# Altium schematic sheet Power Supply.SchDoc
size A4
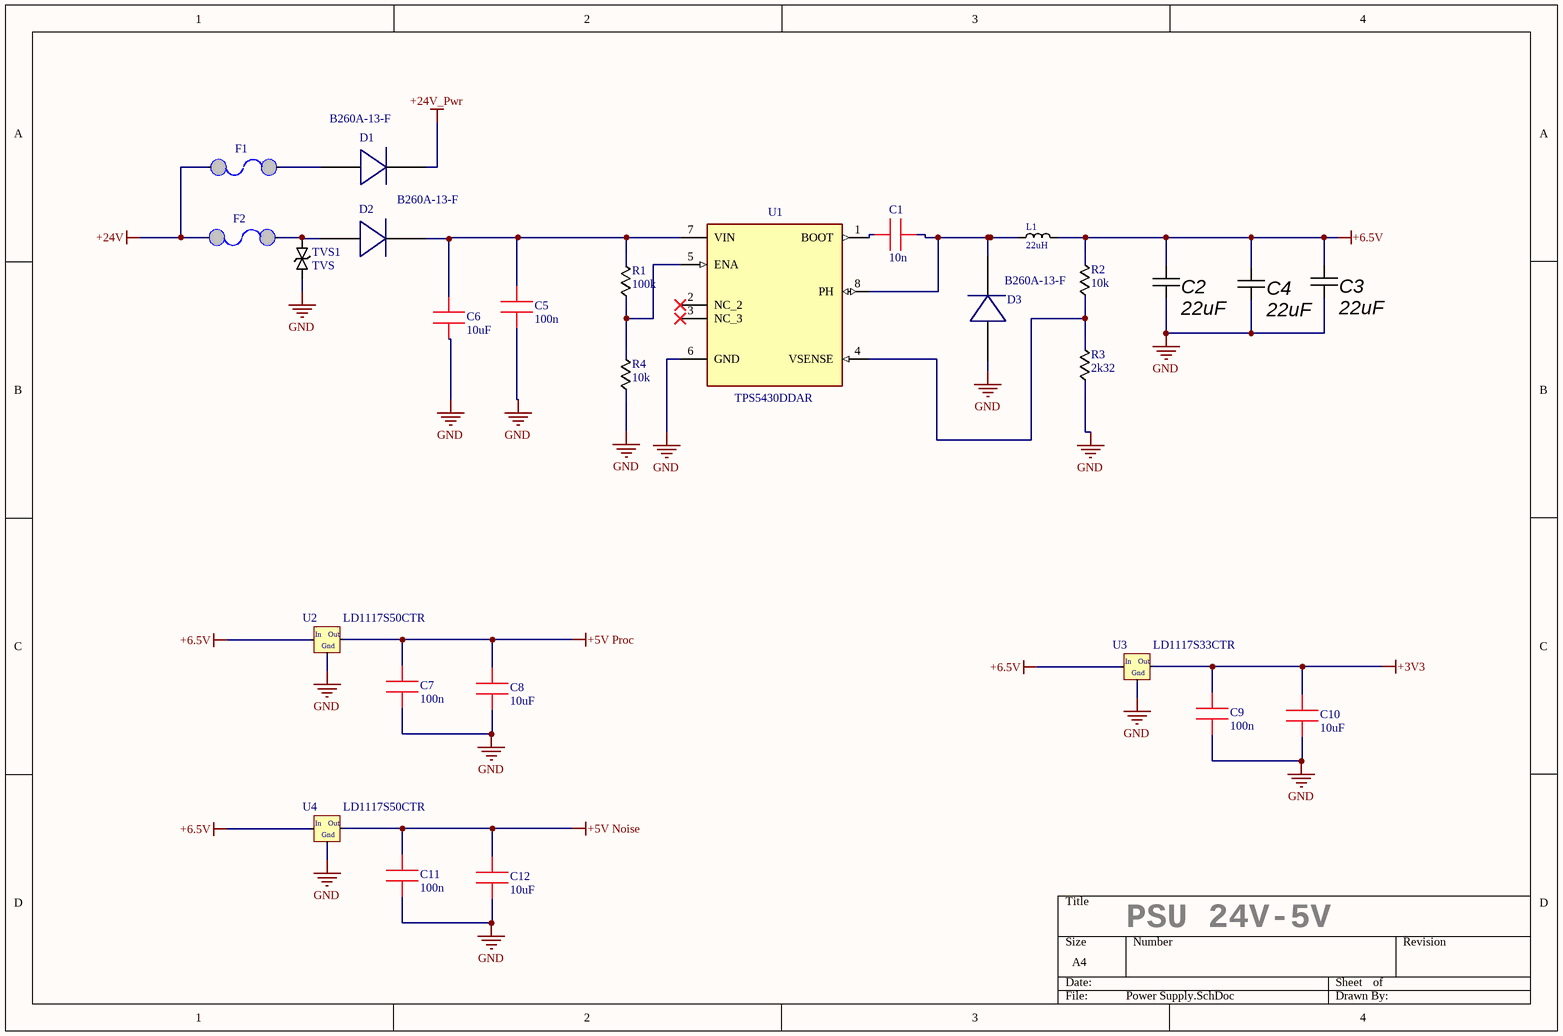
[diagram p0: Power Supply.SchDoc]

## Parts
C1  10n  [0603]
C2  22uF  [0805]
C3  22uF  [0805]
C4  22uF  [0805]
C5  100n  [0603]
C6  10uF  [1210]
C7  100n  [0603]
C8  10uF  [0603]
C9  100n  [0603]
C10  10uF  [0603]
C11  100n  [0603]
C12  10uF  [0603]
D1  B260A-13-F  [DO-214Pol]
D2  B260A-13-F  [DO-214Pol]
D3  B260A-13-F  [DO-214Pol]
F1  Resettable FUSE  [1812]  (value not drawn)
F2  Resettable FUSE  [1812]  (value not drawn)
L1  22uH  [CDRH127]
R1  100k  [0603]
R2  10k  [0603]
R3  2k32  [0603]
R4  10k  [0603]
TVS1  TVS  [DO-214AC]
U1  TPS5430DDAR  [SOIC-8 + Thermal Pad]
U2  LD1117S50CTR  [SOT223]
U3  LD1117S33CTR  [SOT223]
U4  LD1117S50CTR  [SOT223]

## Nets
+3V3: C9.1 C10.1 U3.2(OUT)
+5V Noise: C11.1 C12.1 U4.2(OUT)
+5V Proc: C7.1 C8.1 U2.2(OUT)
+6.5V: C2.2 C3.2 C4.2 L1.2 R2.2 U2.3(IN) U3.3(IN) U4.3(IN)
+24V: F1.2 F2.2
+24V_Pwr: D1.1
GND: C2.1 C3.1 C4.1 C5.1 C6.2 C7.2 C8.2 C9.2 C10.2 C11.2 C12.2 D3.2 R3.1 R4.1 TVS1.2 U1.6(GND) U2.1(GND) U3.1(GND) U4.1(GND)
NetC1_1: C1.1 D3.1 L1.1 U1.8(PH)
NetC1_2: C1.2 U1.1(BOOT)
NetC5_2: C5.2 C6.1 D2.1 R1.2 U1.7(VIN)
NetD1_2: D1.2 F1.1
NetD2_2: D2.2 F2.1 TVS1.1
NetR1_1: R1.1 R4.2 U1.5(ENA)
NetR2_1: R2.1 R3.2 U1.4(VSENSE)

Not connected (* = marked no-connect by the designer): U1 2(NC_2)* 3(NC_3)*

## Notes on the sheet
- PSU 24V-5V
- (in symbol ldo) In; Out; Gnd

## Library data of the parts
C1 = 0603 CAP: CC0603JRX7R9BB103
C2-C4 = Capacitor: CC0805MKX5R6BB226; Value: 100 нФ; Type: Конденсатор ЧИП; Power/Voltage: 50В; Tolerance: 10%; Name: 0805
C5 C7 C9 C11 = 0603 CAP: CC0603KRX7R9BB104
C6 = 1206 Cap: GRM32ER71H106KA12L
C8 C10 C12 = 0603 CAP: GRM188R61C106MA73D
F1 F2 = Fuse PTS: MF-MSMF030-2
L1 = Inductor CDRH127: CDRH127/LDNP-220MC; Value: 22uH
R1 = 0603 RES: RC0603FR-10100KL
R2 R4 = 0603 RES: RT0603FRE0710KL
R3 = 0603 RES: RC0603FR-072K32L
TVS1 = TVS: SMAJ30CA
U2-U4 = ldo